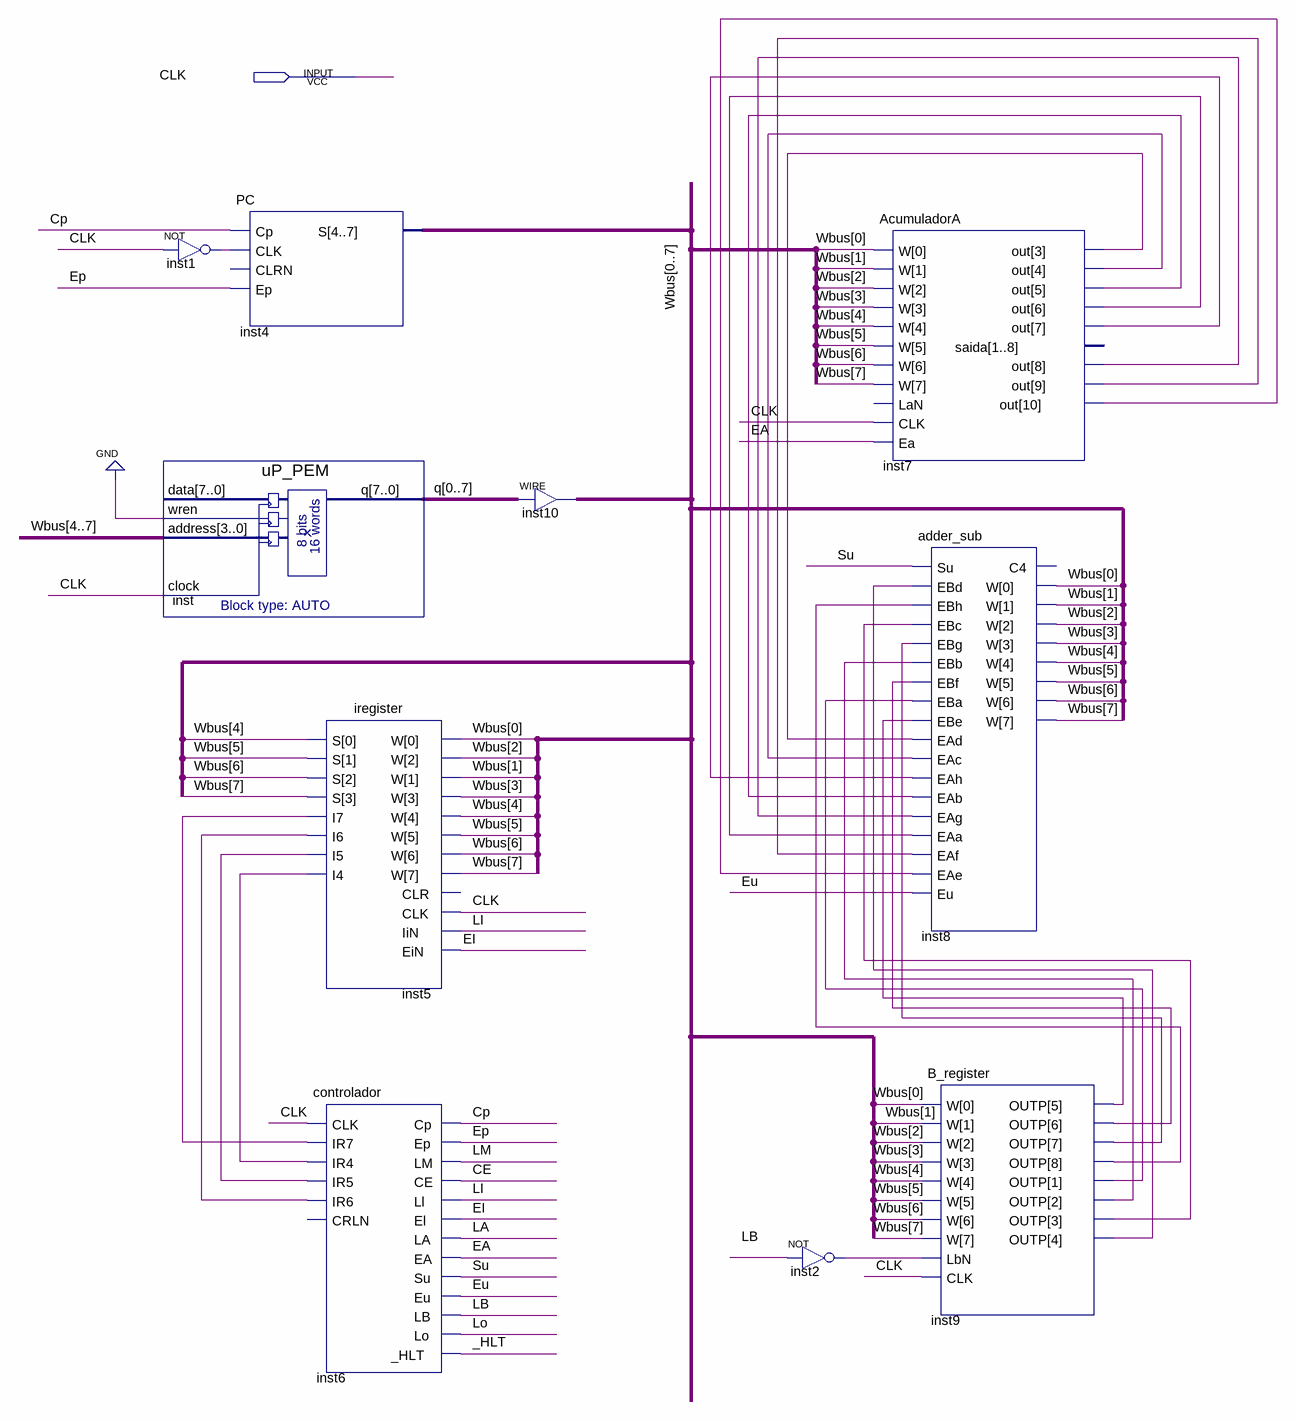
[diagram p0: schematic sheet]
// Quartus schematic uP.bdf as structural Verilog: 10 symbols, 1 pins
module uP (
  input  CLK
);

  wire _HLT, CE, Cp, EA, EI, Ep, Eu, inst1_out, inst2_out, inst5_i4, inst5_i5, inst5_i6, inst5_i7, inst7_out,
       inst7_out_2, inst7_out_3, inst7_out_4, inst7_out_5, inst7_out_6, inst7_out_7, inst7_out_8, inst9_outp,
       inst9_outp_2, inst9_outp_3, inst9_outp_4, inst9_outp_5, inst9_outp_6, inst9_outp_7, inst9_outp_8, LA,
       LB, LI, LM, Lo, Su;
  wire [7:0] q, Wbus;

  PC inst4 (
    .Cp(Cp), .CLK(inst1_out), .Ep(Ep),
    .S({Wbus[0], Wbus[1], Wbus[2], Wbus[3], Wbus[4], Wbus[5], Wbus[6], Wbus[7]}));  // open: CLRN
  not inst1 (inst1_out, CLK);
  uP_PEM inst (
    .wren(1'b0), .address({Wbus[4], Wbus[5], Wbus[6], Wbus[7]}), .clock(CLK),
    .q({q[0], q[1], q[2], q[3], q[4], q[5], q[6], q[7]}));  // open: data
  iregister inst5 (
    .W(Wbus), .CLK(CLK), .IiN(LI), .EiN(EI), .S(Wbus[7:4]), .I7(inst5_i7), .I6(inst5_i6), .I5(inst5_i5),
    .I4(inst5_i4));  // open: CLR
  controlador inst6 (
    .CLK(CLK), .IR7(inst5_i7), .IR4(inst5_i4), .IR5(inst5_i5), .IR6(inst5_i6), .Cp(Cp), .Ep(Ep), .LM(LM),
    .CE(CE), .Ll(LI), .El(EI), .LA(LA), .EA(EA), .Su(Su), .Eu(Eu), .LB(LB), .Lo(Lo), ._HLT(_HLT));  // open: CRLN
  assign {Wbus[0], Wbus[1], Wbus[2], Wbus[3], Wbus[4], Wbus[5], Wbus[6], Wbus[7]} = {q[0], q[1], q[2], q[3], q[4], q[5], q[6], q[7]};  // WIRE inst10
  not inst2 (inst2_out, LB);
  AcumuladorA inst7 (
    .W(Wbus), .CLK(CLK), .Ea(EA),
    .out({inst7_out_8, inst7_out_7, inst7_out_6, inst7_out_5, inst7_out_4, inst7_out_3, inst7_out_2, inst7_out}));  // open: LaN, saida
  adder_sub inst8 (
    .Su(Su), .EBd(inst9_outp), .EBh(inst9_outp_8), .EBc(inst9_outp_2), .EBg(inst9_outp_7),
    .EBb(inst9_outp_3), .EBf(inst9_outp_6), .EBa(inst9_outp_4), .EBe(inst9_outp_5), .EAd(inst7_out),
    .EAc(inst7_out_2), .EAh(inst7_out_5), .EAb(inst7_out_3), .EAg(inst7_out_6), .EAa(inst7_out_4),
    .EAf(inst7_out_7), .EAe(inst7_out_8), .Eu(Eu), .W(Wbus));  // open: C4
  B_register inst9 (
    .W(Wbus), .LbN(inst2_out), .CLK(CLK),
    .OUTP({inst9_outp_8, inst9_outp_7, inst9_outp_6, inst9_outp_5, inst9_outp, inst9_outp_2, inst9_outp_3, inst9_outp_4}));
endmodule
